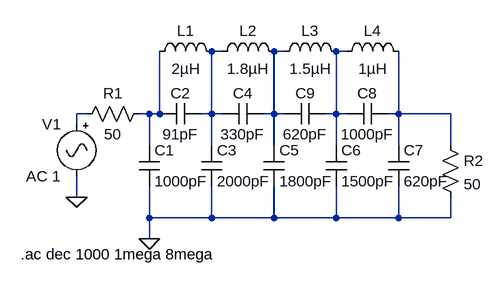
[diagram p0: schematic elliptical_LPF_N10_4MHz.asc]
elliptical_LPF_N10_4MHz.asc, the LTspice schematic file:
Version 4
SHEET 1 880 680
WIRE 304 -16 288 -16
WIRE 400 -16 384 -16
WIRE 496 -16 480 -16
WIRE 96 80 80 80
WIRE 192 80 176 80
WIRE 208 80 208 -16
WIRE 208 80 192 80
WIRE 288 80 288 -16
WIRE 288 80 272 80
WIRE 304 80 288 80
WIRE 384 80 384 -16
WIRE 384 80 368 80
WIRE 400 80 384 80
WIRE 480 80 480 -16
WIRE 480 80 464 80
WIRE 496 80 480 80
WIRE 576 80 576 -16
WIRE 576 80 560 80
WIRE 656 80 576 80
WIRE 80 96 80 80
WIRE 192 128 192 80
WIRE 288 128 288 80
WIRE 384 128 384 80
WIRE 480 128 480 80
WIRE 576 128 576 80
WIRE 656 128 656 80
WIRE 80 208 80 176
WIRE 192 240 192 192
WIRE 288 240 288 192
WIRE 288 240 192 240
WIRE 384 240 384 192
WIRE 384 240 288 240
WIRE 480 240 480 192
WIRE 480 240 384 240
WIRE 576 240 576 192
WIRE 576 240 480 240
WIRE 656 240 656 208
WIRE 656 240 576 240
WIRE 192 272 192 240
FLAG 80 208 0
FLAG 192 272 0
SYMBOL Misc\\signal 80 80 M0
SYMATTR InstName V1
SYMATTR Value AC 1
SYMBOL res 80 96 R270
WINDOW 0 32 56 VTop 2
WINDOW 3 0 56 VBottom 2
SYMATTR InstName R1
SYMATTR Value 50
SYMBOL cap 176 128 R0
SYMATTR InstName C1
SYMATTR Value 1000pF
SYMBOL cap 208 96 R270
WINDOW 0 32 32 VTop 2
WINDOW 3 0 32 VBottom 2
SYMATTR InstName C2
SYMATTR Value 91pF
SYMBOL cap 272 128 R0
SYMATTR InstName C3
SYMATTR Value 2000pF
SYMBOL cap 304 96 R270
WINDOW 0 32 32 VTop 2
WINDOW 3 0 32 VBottom 2
SYMATTR InstName C4
SYMATTR Value 330pF
SYMBOL cap 368 128 R0
SYMATTR InstName C5
SYMATTR Value 1800pF
SYMBOL cap 464 192 M180
WINDOW 0 24 56 Left 2
WINDOW 3 24 8 Left 2
SYMATTR InstName C6
SYMATTR Value 1500pF
SYMBOL cap 560 128 R0
SYMATTR InstName C7
SYMATTR Value 620pF
SYMBOL cap 560 96 M270
WINDOW 0 32 32 VTop 2
WINDOW 3 0 32 VBottom 2
SYMATTR InstName C8
SYMATTR Value 1000pF
SYMBOL cap 400 96 R270
WINDOW 0 32 32 VTop 2
WINDOW 3 0 32 VBottom 2
SYMATTR InstName C9
SYMATTR Value 620pF
SYMBOL ind 192 0 R270
WINDOW 0 32 56 VTop 2
WINDOW 3 5 56 VBottom 2
SYMATTR InstName L1
SYMATTR Value 2µH
SYMATTR SpiceLine Rser=0.2
SYMBOL ind 288 0 R270
WINDOW 0 32 56 VTop 2
WINDOW 3 5 56 VBottom 2
SYMATTR InstName L2
SYMATTR Value 1.8µH
SYMATTR SpiceLine Rser=0.2
SYMBOL ind 384 0 R270
WINDOW 0 32 56 VTop 2
WINDOW 3 5 56 VBottom 2
SYMATTR InstName L3
SYMATTR Value 1.5µH
SYMATTR SpiceLine Rser=0.2
SYMBOL ind 480 0 R270
WINDOW 0 32 56 VTop 2
WINDOW 3 5 56 VBottom 2
SYMATTR InstName L4
SYMATTR Value 1µH
SYMATTR SpiceLine Rser=0.2
SYMBOL res 640 112 R0
SYMATTR InstName R2
SYMATTR Value 50
TEXT -6 296 Left 2 !.ac dec 1000 1mega 8mega

The netlist it stands for:
* elliptical_LPF_N10_4MHz.asc
V1 N004 0 AC 1
R1 N004 N005 50
C1 N005 0 1000pF
C2 N005 N001 91pF
C3 N001 0 2000pF
C4 N001 N002 330pF
C5 N002 0 1800pF
C6 0 N003 1500pF
C7 N006 0 620pF
C8 N006 N003 1000pF
C9 N002 N003 620pF
L1 N005 N001 2µH Rser=0.2
L2 N001 N002 1.8µH Rser=0.2
L3 N002 N003 1.5µH Rser=0.2
L4 N003 N006 1µH Rser=0.2
R2 N006 0 50
.ac dec 1000 1mega 8mega
.backanno
.end